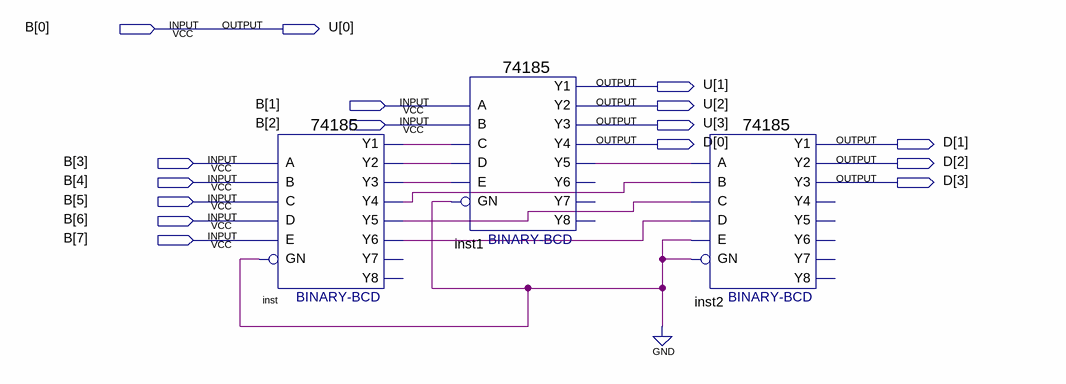
[diagram p0: schematic sheet]
// Quartus schematic BinToBCD.bdf as structural Verilog: 3 symbols, 16 pins
module BinToBCD (
  input  [7:0] B,
  output [3:0] U,
  output [3:0] D
);

  wire inst1_y5, inst_y1, inst_y2, inst_y3, inst_y4, inst_y5, inst_y6;

  \74185  inst (
    .A(B[3]), .B(B[4]), .D(B[6]), .C(B[5]), .E(B[7]), .GN(1'b0), .Y1(inst_y1), .Y3(inst_y3), .Y2(inst_y2),
    .Y5(inst_y5), .Y4(inst_y4), .Y6(inst_y6));  // open: Y8, Y7
  \74185  inst1 (
    .A(B[1]), .B(B[2]), .D(inst_y2), .C(inst_y1), .E(inst_y3), .GN(1'b0), .Y1(U[1]), .Y3(U[3]), .Y2(U[2]),
    .Y5(inst1_y5), .Y4(D[0]));  // open: Y6, Y8, Y7
  \74185  inst2 (
    .A(inst1_y5), .B(inst_y4), .D(inst_y6), .C(inst_y5), .E(1'b0), .GN(1'b0), .Y1(D[1]), .Y3(D[3]), .Y2(D[2]));  // open: Y5, Y4, Y6, Y8, Y7

  assign U[0] = B[0];
endmodule
